# EAGLE design Desertlure (EAGLE 7.3.0)
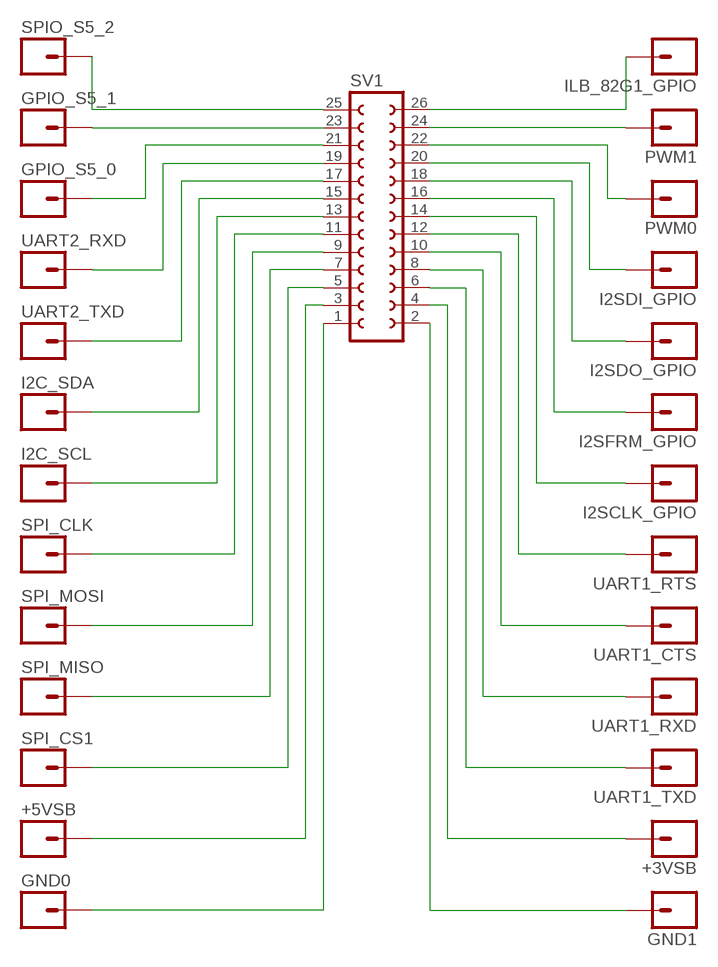
[diagram p0: schematic, sheet 1]

## Parts
+3VSB  M01NOSILK-KIT  [1X01NS-KIT]
+5VSB  M01NOSILK-KIT  [1X01NS-KIT]
GND0  M01NOSILK-KIT  [1X01NS-KIT]
GND1  M01NOSILK-KIT  [1X01NS-KIT]
GPIO_S5_0  M01NOSILK-KIT  [1X01NS-KIT]
GPIO_S5_1  M01NOSILK-KIT  [1X01NS-KIT]
I2C_SCL  M01NOSILK-KIT  [1X01NS-KIT]
I2C_SDA  M01NOSILK-KIT  [1X01NS-KIT]
I2SCLK_GPIO  M01NOSILK-KIT  [1X01NS-KIT]
I2SDI_GPIO  M01NOSILK-KIT  [1X01NS-KIT]
I2SDO_GPIO  M01NOSILK-KIT  [1X01NS-KIT]
I2SFRM_GPIO  M01NOSILK-KIT  [1X01NS-KIT]
ILB_82G1_GPIO  M01NOSILK-KIT  [1X01NS-KIT]
PWM0  M01NOSILK-KIT  [1X01NS-KIT]
PWM1  M01NOSILK-KIT  [1X01NS-KIT]
SPI_CLK  M01NOSILK-KIT  [1X01NS-KIT]
SPI_CS1  M01NOSILK-KIT  [1X01NS-KIT]
SPI_MISO  M01NOSILK-KIT  [1X01NS-KIT]
SPI_MOSI  M01NOSILK-KIT  [1X01NS-KIT]
SPIO_S5_2  M01NOSILK-KIT  [1X01NS-KIT]
SV1  FE13-2W  [FE13-2W]
UART1_CTS  M01NOSILK-KIT  [1X01NS-KIT]
UART1_RTS  M01NOSILK-KIT  [1X01NS-KIT]
UART1_RXD  M01NOSILK-KIT  [1X01NS-KIT]
UART1_TXD  M01NOSILK-KIT  [1X01NS-KIT]
UART2_RXD  M01NOSILK-KIT  [1X01NS-KIT]
UART2_TXD  M01NOSILK-KIT  [1X01NS-KIT]

## Nets
N$1: GND0.1 SV1.1
N$2: +5VSB.1 SV1.3
N$3: SPI_CS1.1 SV1.5
N$4: SPI_MISO.1 SV1.7
N$5: SPI_MOSI.1 SV1.9
N$6: SPI_CLK.1 SV1.11
N$7: I2C_SCL.1 SV1.13
N$8: I2C_SDA.1 SV1.15
N$9: SV1.17 UART2_TXD.1
N$10: SV1.19 UART2_RXD.1
N$11: GPIO_S5_0.1 SV1.21
N$12: GPIO_S5_1.1 SV1.23
N$13: SPIO_S5_2.1 SV1.25
N$14: GND1.1 SV1.2
N$15: +3VSB.1 SV1.4
N$16: SV1.6 UART1_TXD.1
N$17: SV1.8 UART1_RXD.1
N$18: SV1.10 UART1_CTS.1
N$19: SV1.12 UART1_RTS.1
N$20: I2SCLK_GPIO.1 SV1.14
N$21: I2SFRM_GPIO.1 SV1.16
N$22: I2SDO_GPIO.1 SV1.18
N$23: I2SDI_GPIO.1 SV1.20
N$24: PWM0.1 SV1.22
N$25: PWM1.1 SV1.24
N$26: ILB_82G1_GPIO.1 SV1.26

## Library data of the parts
+3VSB +5VSB GND0 GND1 GPIO_S5_0 GPIO_S5_1 I2C_SCL I2C_SDA I2SCLK_GPIO I2SDI_GPIO I2SDO_GPIO I2SFRM_GPIO ILB_82G1_GPIO PWM0 PWM1 SPI_CLK SPI_CS1 SPI_MISO SPI_MOSI SPIO_S5_2 UART1_CTS UART1_RTS UART1_RXD UART1_TXD UART2_RXD UART2_TXD = SparkFun-Connectors:M01: Header 1 Standard 1-pin 0.1" header. Use with straight break away headers (SKU : PRT-00116), right angle break away headers (PRT-00553), swiss pins (PRT-00743), machine pins (PRT-00117), and female headers (PRT-00115).
SV1 = con-lsta:FE13-2W: FEMALE HEADER; OC_FARNELL: unknown; OC_NEWARK: unknown

## Board
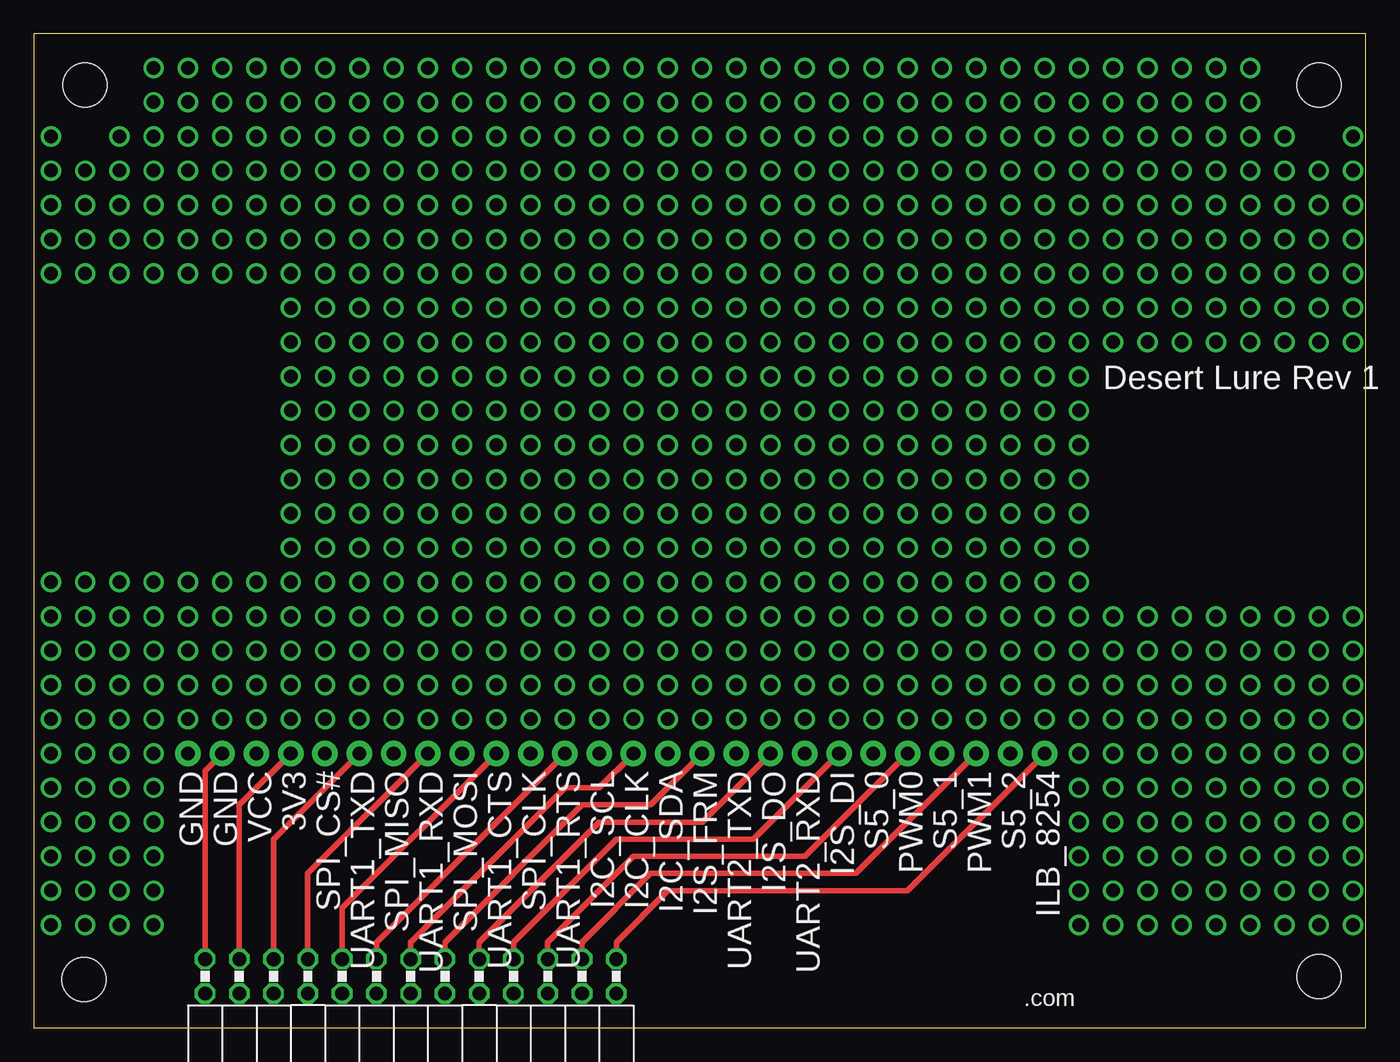
[diagram p1: board, top side]
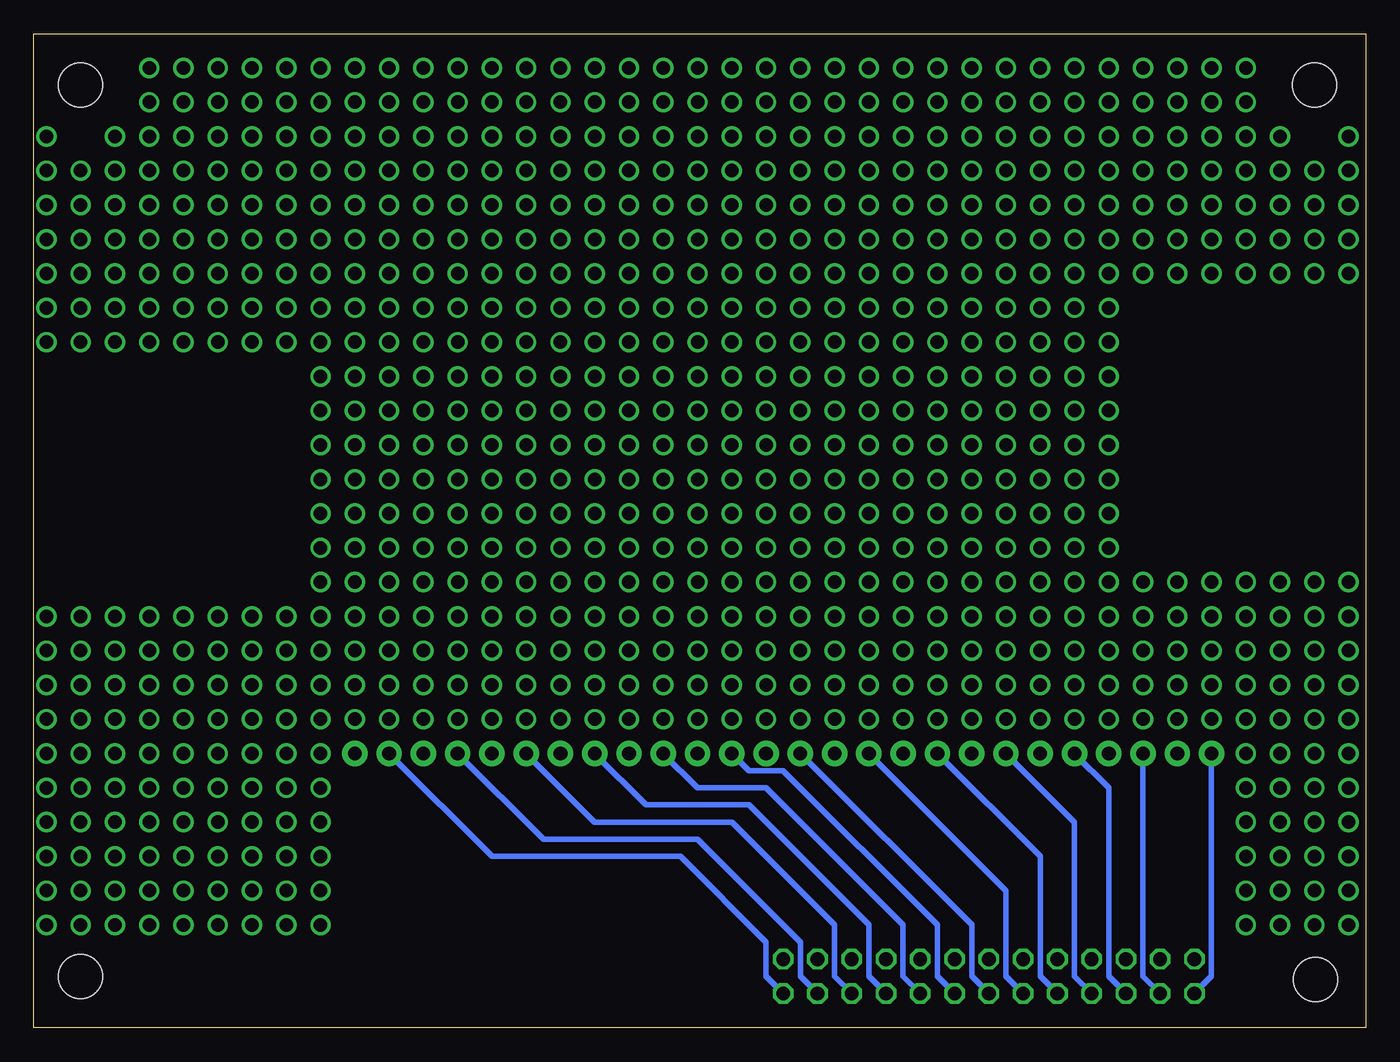
[diagram p2: board, bottom side, seen from below]

Size 98.73 x 73.65 mm. Coordinates in mm from the lower left corner, seen from the top.
Outline: 0,0 98.73,0 98.73,73.65 0,73.65 0,0
Copper layers (1*16): Top 0.035mm / dielectric 1.5mm / Bottom 0.035mm
Design rules "default": minimum track width 10mil, minimum drill 24mil, track to track 8mil, track to pad 8mil, pad to pad 8mil, via to via 8mil, smd to smd 8mil, copper to edge 40mil, drill to drill 8mil, minimum pad ring 10mil, minimum via ring 8mil, stop-mask expansion 4mil, vias tented up to drill 0mil, thermal gap 10mil
Holes 3.28 mm at 3.71,3.58 95.25,3.81 95.25,69.85 3.81,69.85

### Footprints (pad centres in the part's own frame; a part is rotated, then mirrored left to right if it is on the bottom)
1X01NS-KIT = drill 1.016 pad 1.88: 1 0,0
FE13-2W = drill 1.016 octagon: 1 -15.24,1.27; 2 -15.24,-1.27; 3 -12.7,1.27; 4 -12.7,-1.27; 5 -10.16,1.27; 6 -10.16,-1.27; 7 -7.62,1.27; 8 -7.62,-1.27; 9 -5.08,1.27; 10 -5.08,-1.27; 11 -2.54,1.27; 12 -2.54,-1.27; 13 0,1.27; 14 0,-1.27; 15 2.54,1.27; 16 2.54,-1.27; 17 5.08,1.27; 18 5.08,-1.27; 19 7.62,1.27; 20 7.62,-1.27; 21 10.16,1.27; 22 10.16,-1.27; 23 12.7,1.27; 24 12.7,-1.27; 25 15.24,1.27; 26 15.24,-1.27

### Placement (x,y rotation side)
+3VSB  16.51,20.32 0 top
+5VSB  19.05,20.32 0 top
GND0  13.97,20.32 0 top
GND1  11.43,20.32 0 top
GPIO_S5_0  64.77,20.32 0 top
GPIO_S5_1  69.85,20.32 0 top
I2C_SCL  44.45,20.32 0 top
I2C_SDA  49.53,20.32 0 top
I2SCLK_GPIO  41.91,20.32 0 top
I2SDI_GPIO  57.15,20.32 0 top
I2SDO_GPIO  52.07,20.32 0 top
I2SFRM_GPIO  46.99,20.32 0 top
ILB_82G1_GPIO  72.39,20.32 0 top
PWM0  62.23,20.32 0 top
PWM1  67.31,20.32 0 top
SPI_CLK  39.37,20.32 0 top
SPI_CS1  24.13,20.32 0 top
SPI_MISO  29.21,20.32 0 top
SPI_MOSI  34.29,20.32 0 top
SPIO_S5_2  74.93,20.32 0 top
SV1  27.94,3.81 0 top
UART1_CTS  31.75,20.32 0 top
UART1_RTS  36.83,20.32 0 top
UART1_RXD  26.67,20.32 0 top
UART1_TXD  21.59,20.32 0 top
UART2_RXD  59.69,20.32 0 top
UART2_TXD  54.61,20.32 0 top

### Tracks (layer width: path | path; a pad name or v marks a point on that pad's centre or on a via)
N$1
  Top 0.406: SV1.1 12.7,19.05 GND0.1
N$2
  Top 0.406: SV1.3 15.24,16.51 +5VSB.1
N$3
  Top 0.406: SV1.5 17.78,13.97 SPI_CS1.1
N$4
  Top 0.406: SV1.7 20.32,11.43 SPI_MISO.1
N$5
  Top 0.406: SV1.9 22.86,8.89 SPI_MOSI.1
N$6
  Top 0.406: SV1.11 25.4,6.35 SPI_CLK.1
N$7
  Top 0.406: SV1.13 27.94,6.35 39.37,17.78 41.91,17.78 I2C_SCL.1
N$8
  Top 0.406: SV1.15 30.48,6.35 40.64,16.51 45.72,16.51 I2C_SDA.1
N$9
  Top 0.406: SV1.17 33.02,6.35 41.91,15.24 49.53,15.24 UART2_TXD.1
N$10
  Top 0.406: SV1.19 35.56,6.35 43.18,13.97 53.34,13.97 UART2_RXD.1
N$11
  Top 0.406: SV1.21 38.1,6.35 44.45,12.7 57.15,12.7 GPIO_S5_0.1
N$12
  Top 0.406: SV1.23 40.64,6.35 45.72,11.43 60.96,11.43 GPIO_S5_1.1
N$13
  Top 0.406: SV1.25 43.18,6.35 46.99,10.16 64.77,10.16 SPIO_S5_2.1
N$14
  Bottom 0.406: SV1.2 11.43,3.81 GND1.1
N$15
  Bottom 0.406: SV1.4 16.51,3.81 +3VSB.1
N$16
  Bottom 0.406: SV1.6 19.05,3.81 19.05,17.78 UART1_TXD.1
N$17
  Bottom 0.406: SV1.8 21.59,3.81 21.59,15.24 UART1_RXD.1
N$18
  Bottom 0.406: SV1.10 24.13,3.81 24.13,12.7 UART1_CTS.1
N$19
  Bottom 0.406: SV1.12 26.67,3.81 26.67,10.16 UART1_RTS.1
N$20
  Bottom 0.406: SV1.14 29.21,3.81 29.21,7.62 I2SCLK_GPIO.1
N$21
  Bottom 0.406: SV1.16 31.75,3.81 31.75,7.62 43.18,19.05 45.72,19.05 I2SFRM_GPIO.1
N$22
  Bottom 0.406: SV1.18 34.29,3.81 34.29,7.62 44.45,17.78 49.53,17.78 I2SDO_GPIO.1
N$23
  Bottom 0.406: SV1.20 36.83,3.81 36.83,7.62 45.72,16.51 53.34,16.51 I2SDI_GPIO.1
N$24
  Bottom 0.406: SV1.22 39.37,3.81 39.37,7.62 46.99,15.24 57.15,15.24 PWM0.1
N$25
  Bottom 0.406: SV1.24 41.91,3.81 41.91,6.35 49.53,13.97 60.96,13.97 PWM1.1
N$26
  Bottom 0.406: SV1.26 44.45,3.81 44.45,6.35 50.8,12.7 64.77,12.7 ILB_82G1_GPIO.1
N$27  (via drill 1)
  other vias: 11.43,22.86
N$28  (via drill 1)
  other vias: 13.97,22.86
N$29  (via drill 1)
  other vias: 16.51,22.86
N$30  (via drill 1)
  other vias: 19.05,22.86
N$31  (via drill 1)
  other vias: 21.59,22.86
N$32  (via drill 1)
  other vias: 24.13,22.86
N$33  (via drill 1)
  other vias: 26.67,22.86
N$34  (via drill 1)
  other vias: 29.21,22.86
N$35  (via drill 1)
  other vias: 31.75,22.86
N$36  (via drill 1)
  other vias: 34.29,22.86
N$37  (via drill 1)
  other vias: 36.83,22.86
N$38  (via drill 1)
  other vias: 39.37,22.86
N$39  (via drill 1)
  other vias: 41.91,22.86
N$40  (via drill 1)
  other vias: 44.45,22.86
N$41  (via drill 1)
  other vias: 46.99,22.86
N$42  (via drill 1)
  other vias: 49.53,22.86
N$43  (via drill 1)
  other vias: 52.07,22.86
N$44  (via drill 1)
  other vias: 54.61,22.86
N$45  (via drill 1)
  other vias: 57.15,22.86
N$46  (via drill 1)
  other vias: 59.69,22.86
N$47  (via drill 1)
  other vias: 62.23,22.86
N$48  (via drill 1)
  other vias: 64.77,22.86
N$49  (via drill 1)
  other vias: 67.31,22.86
N$50  (via drill 1)
  other vias: 69.85,22.86
N$51  (via drill 1)
  other vias: 72.39,22.86
N$52  (via drill 1)
  other vias: 74.93,22.86
N$53  (via drill 1)
  other vias: 74.93,25.4
N$54  (via drill 1)
  other vias: 77.47,22.86
N$55  (via drill 1)
  other vias: 77.47,20.32
N$56  (via drill 1)
  other vias: 77.47,25.4
N$57  (via drill 1)
  other vias: 72.39,25.4
N$58  (via drill 1)
  other vias: 69.85,25.4
N$59  (via drill 1)
  other vias: 67.31,25.4
N$60  (via drill 1)
  other vias: 64.77,25.4
N$61  (via drill 1)
  other vias: 62.23,25.4
N$62  (via drill 1)
  other vias: 59.69,25.4
N$63  (via drill 1)
  other vias: 57.15,25.4
N$64  (via drill 1)
  other vias: 54.61,25.4
N$65  (via drill 1)
  other vias: 52.07,25.4
N$66  (via drill 1)
  other vias: 49.53,25.4
N$67  (via drill 1)
  other vias: 46.99,25.4
N$68  (via drill 1)
  other vias: 44.45,25.4
N$69  (via drill 1)
  other vias: 41.91,25.4
N$70  (via drill 1)
  other vias: 39.37,25.4
N$71  (via drill 1)
  other vias: 36.83,25.4
N$72  (via drill 1)
  other vias: 34.29,25.4
N$73  (via drill 1)
  other vias: 31.75,25.4
N$74  (via drill 1)
  other vias: 29.21,25.4
N$75  (via drill 1)
  other vias: 26.67,25.4
N$76  (via drill 1)
  other vias: 24.13,25.4
N$77  (via drill 1)
  other vias: 21.59,25.4
N$78  (via drill 1)
  other vias: 19.05,25.4
N$79  (via drill 1)
  other vias: 16.51,25.4
N$80  (via drill 1)
  other vias: 13.97,25.4
N$81  (via drill 1)
  other vias: 11.43,25.4
N$82  (via drill 1)
  other vias: 8.89,25.4
N$83  (via drill 1)
  other vias: 8.89,22.86
N$84  (via drill 1)
  other vias: 8.89,20.32
N$85  (via drill 1)
  other vias: 6.35,20.32
N$86  (via drill 1)
  other vias: 6.35,22.86
N$87  (via drill 1)
  other vias: 6.35,25.4
N$88  (via drill 1)
  other vias: 3.81,25.4
N$89  (via drill 1)
  other vias: 3.81,22.86
N$90  (via drill 1)
  other vias: 3.81,20.32
N$91  (via drill 1)
  other vias: 3.81,17.78
N$92  (via drill 1)
  other vias: 6.35,17.78
N$93  (via drill 1)
  other vias: 8.89,17.78
N$94  (via drill 1)
  other vias: 3.81,15.24
N$95  (via drill 1)
  other vias: 6.35,15.24
N$96  (via drill 1)
  other vias: 8.89,15.24
N$97  (via drill 1)
  other vias: 3.81,12.7
N$98  (via drill 1)
  other vias: 6.35,12.7
N$99  (via drill 1)
  other vias: 8.89,12.7
N$100  (via drill 1)
  other vias: 80.01,22.86
N$101  (via drill 1)
  other vias: 82.55,22.86
N$102  (via drill 1)
  other vias: 85.09,22.86
N$103  (via drill 1)
  other vias: 87.63,22.86
N$104  (via drill 1)
  other vias: 90.17,22.86
N$105  (via drill 1)
  other vias: 92.71,22.86
N$106  (via drill 1)
  other vias: 95.25,22.86
N$107  (via drill 1)
  other vias: 97.79,22.86
N$108  (via drill 1)
  other vias: 80.01,20.32
N$109  (via drill 1)
  other vias: 77.47,17.78
N$110  (via drill 1)
  other vias: 80.01,17.78
N$111  (via drill 1)
  other vias: 77.47,15.24
N$112  (via drill 1)
  other vias: 80.01,15.24
N$113  (via drill 1)
  other vias: 1.27,20.32
N$114  (via drill 1)
  other vias: 1.27,17.78
N$115  (via drill 1)
  other vias: 1.27,15.24
N$116  (via drill 1)
  other vias: 1.27,12.7
N$117  (via drill 1)
  other vias: 1.27,10.16
N$118  (via drill 1)
  other vias: 3.81,10.16
N$119  (via drill 1)
  other vias: 6.35,10.16
N$120  (via drill 1)
  other vias: 8.89,10.16
N$121  (via drill 1)
  other vias: 8.89,7.62
N$122  (via drill 1)
  other vias: 6.35,7.62
N$123  (via drill 1)
  other vias: 3.81,7.62
N$124  (via drill 1)
  other vias: 1.27,7.62
N$125  (via drill 1)
  other vias: 82.55,20.32
N$126  (via drill 1)
  other vias: 82.55,17.78
N$127  (via drill 1)
  other vias: 82.55,15.24
N$128  (via drill 1)
  other vias: 82.55,12.7
N$129  (via drill 1)
  other vias: 80.01,12.7
N$130  (via drill 1)
  other vias: 77.47,12.7
N$131  (via drill 1)
  other vias: 77.47,10.16
N$132  (via drill 1)
  other vias: 80.01,10.16
N$133  (via drill 1)
  other vias: 82.55,10.16
N$134  (via drill 1)
  other vias: 85.09,20.32
N$135  (via drill 1)
  other vias: 85.09,17.78
N$136  (via drill 1)
  other vias: 85.09,15.24
N$137  (via drill 1)
  other vias: 85.09,12.7
N$138  (via drill 1)
  other vias: 85.09,10.16
N$139  (via drill 1)
  other vias: 87.63,20.32
N$140  (via drill 1)
  other vias: 87.63,17.78
N$141  (via drill 1)
  other vias: 87.63,15.24
N$142  (via drill 1)
  other vias: 87.63,12.7
N$143  (via drill 1)
  other vias: 87.63,10.16
N$144  (via drill 1)
  other vias: 90.17,20.32
N$145  (via drill 1)
  other vias: 90.17,17.78
N$146  (via drill 1)
  other vias: 90.17,15.24
N$147  (via drill 1)
  other vias: 90.17,12.7
N$148  (via drill 1)
  other vias: 90.17,10.16
N$149  (via drill 1)
  other vias: 92.71,20.32
N$150  (via drill 1)
  other vias: 92.71,17.78
N$151  (via drill 1)
  other vias: 92.71,15.24
N$152  (via drill 1)
  other vias: 92.71,12.7
N$153  (via drill 1)
  other vias: 92.71,10.16
N$154  (via drill 1)
  other vias: 95.25,20.32
N$155  (via drill 1)
  other vias: 95.25,17.78
N$156  (via drill 1)
  other vias: 95.25,15.24
N$157  (via drill 1)
  other vias: 95.25,12.7
N$158  (via drill 1)
  other vias: 95.25,10.16
N$159  (via drill 1)
  other vias: 97.79,20.32
N$160  (via drill 1)
  other vias: 97.79,17.78
N$161  (via drill 1)
  other vias: 97.79,15.24
N$162  (via drill 1)
  other vias: 97.79,12.7
N$163  (via drill 1)
  other vias: 97.79,10.16
N$164  (via drill 1)
  other vias: 80.01,25.4
N$165  (via drill 1)
  other vias: 82.55,25.4
N$166  (via drill 1)
  other vias: 85.09,25.4
N$167  (via drill 1)
  other vias: 87.63,25.4
N$168  (via drill 1)
  other vias: 90.17,25.4
N$169  (via drill 1)
  other vias: 92.71,25.4
N$170  (via drill 1)
  other vias: 95.25,25.4
N$171  (via drill 1)
  other vias: 97.79,25.4
N$172  (via drill 1)
  other vias: 1.27,25.4
N$173  (via drill 1)
  other vias: 1.27,22.86
N$174  (via drill 1)
  other vias: 77.47,7.62
N$175  (via drill 1)
  other vias: 80.01,7.62
N$176  (via drill 1)
  other vias: 82.55,7.62
N$177  (via drill 1)
  other vias: 85.09,7.62
N$178  (via drill 1)
  other vias: 87.63,7.62
N$179  (via drill 1)
  other vias: 90.17,7.62
N$180  (via drill 1)
  other vias: 92.71,7.62
N$181  (via drill 1)
  other vias: 95.25,7.62
N$182  (via drill 1)
  other vias: 97.79,7.62
N$183  (via drill 1)
  other vias: 1.27,27.94
N$184  (via drill 1)
  other vias: 3.81,27.94
N$185  (via drill 1)
  other vias: 6.35,27.94
N$186  (via drill 1)
  other vias: 8.89,27.94
N$187  (via drill 1)
  other vias: 11.43,27.94
N$188  (via drill 1)
  other vias: 13.97,27.94
N$189  (via drill 1)
  other vias: 16.51,27.94
N$190  (via drill 1)
  other vias: 19.05,27.94
N$191  (via drill 1)
  other vias: 21.59,27.94
N$192  (via drill 1)
  other vias: 24.13,27.94
N$193  (via drill 1)
  other vias: 26.67,27.94
N$194  (via drill 1)
  other vias: 29.21,27.94
N$195  (via drill 1)
  other vias: 31.75,27.94
N$196  (via drill 1)
  other vias: 34.29,27.94
N$197  (via drill 1)
  other vias: 36.83,27.94
N$198  (via drill 1)
  other vias: 39.37,27.94
N$199  (via drill 1)
  other vias: 41.91,27.94
N$200  (via drill 1)
  other vias: 44.45,27.94
N$201  (via drill 1)
  other vias: 46.99,27.94
N$202  (via drill 1)
  other vias: 49.53,27.94
N$203  (via drill 1)
  other vias: 52.07,27.94
N$204  (via drill 1)
  other vias: 54.61,27.94
N$205  (via drill 1)
  other vias: 57.15,27.94
N$206  (via drill 1)
  other vias: 59.69,27.94
N$207  (via drill 1)
  other vias: 62.23,27.94
N$208  (via drill 1)
  other vias: 64.77,27.94
N$209  (via drill 1)
  other vias: 67.31,27.94
N$210  (via drill 1)
  other vias: 69.85,27.94
N$211  (via drill 1)
  other vias: 72.39,27.94
N$212  (via drill 1)
  other vias: 74.93,27.94
N$213  (via drill 1)
  other vias: 77.47,27.94
N$214  (via drill 1)
  other vias: 80.01,27.94
N$215  (via drill 1)
  other vias: 82.55,27.94
N$216  (via drill 1)
  other vias: 85.09,27.94
N$217  (via drill 1)
  other vias: 87.63,27.94
N$218  (via drill 1)
  other vias: 90.17,27.94
N$219  (via drill 1)
  other vias: 92.71,27.94
N$220  (via drill 1)
  other vias: 95.25,27.94
N$221  (via drill 1)
  other vias: 97.79,27.94
N$222  (via drill 1)
  other vias: 97.79,30.48
N$223  (via drill 1)
  other vias: 95.25,30.48
N$224  (via drill 1)
  other vias: 92.71,30.48
N$225  (via drill 1)
  other vias: 90.17,30.48
N$226  (via drill 1)
  other vias: 87.63,30.48
N$227  (via drill 1)
  other vias: 85.09,30.48
N$228  (via drill 1)
  other vias: 82.55,30.48
N$229  (via drill 1)
  other vias: 80.01,30.48
N$230  (via drill 1)
  other vias: 77.47,30.48
N$231  (via drill 1)
  other vias: 74.93,30.48
N$232  (via drill 1)
  other vias: 72.39,30.48
N$233  (via drill 1)
  other vias: 69.85,30.48
N$234  (via drill 1)
  other vias: 67.31,30.48
N$235  (via drill 1)
  other vias: 64.77,30.48
N$236  (via drill 1)
  other vias: 62.23,30.48
N$237  (via drill 1)
  other vias: 59.69,30.48
N$238  (via drill 1)
  other vias: 57.15,30.48
N$239  (via drill 1)
  other vias: 54.61,30.48
N$240  (via drill 1)
  other vias: 52.07,30.48
N$241  (via drill 1)
  other vias: 49.53,30.48
N$242  (via drill 1)
  other vias: 46.99,30.48
N$243  (via drill 1)
  other vias: 44.45,30.48
N$244  (via drill 1)
  other vias: 41.91,30.48
N$245  (via drill 1)
  other vias: 39.37,30.48
N$246  (via drill 1)
  other vias: 36.83,30.48
N$247  (via drill 1)
  other vias: 34.29,30.48
N$248  (via drill 1)
  other vias: 31.75,30.48
N$249  (via drill 1)
  other vias: 29.21,30.48
N$250  (via drill 1)
  other vias: 26.67,30.48
N$251  (via drill 1)
  other vias: 24.13,30.48
N$252  (via drill 1)
  other vias: 21.59,30.48
N$253  (via drill 1)
  other vias: 19.05,30.48
N$254  (via drill 1)
  other vias: 16.51,30.48
N$255  (via drill 1)
  other vias: 13.97,30.48 1.27,33.02
N$256  (via drill 1)
  other vias: 11.43,30.48
N$257  (via drill 1)
  other vias: 8.89,30.48
N$258  (via drill 1)
  other vias: 6.35,30.48
N$259  (via drill 1)
  other vias: 3.81,30.48
N$260  (via drill 1)
  other vias: 1.27,30.48
N$261  (via drill 1)
  other vias: 3.81,33.02
N$262  (via drill 1)
  other vias: 6.35,33.02
N$263  (via drill 1)
  other vias: 8.89,33.02
N$264  (via drill 1)
  other vias: 11.43,33.02
N$265  (via drill 1)
  other vias: 13.97,33.02
N$266  (via drill 1)
  other vias: 16.51,33.02
N$267  (via drill 1)
  other vias: 19.05,33.02
N$268  (via drill 1)
  other vias: 21.59,33.02
N$269  (via drill 1)
  other vias: 24.13,33.02
N$270  (via drill 1)
  other vias: 26.67,33.02
N$271  (via drill 1)
  other vias: 29.21,33.02
N$272  (via drill 1)
  other vias: 31.75,33.02
N$273  (via drill 1)
  other vias: 34.29,33.02
N$274  (via drill 1)
  other vias: 36.83,33.02
N$275  (via drill 1)
  other vias: 39.37,33.02
N$276  (via drill 1)
  other vias: 41.91,33.02
N$277  (via drill 1)
  other vias: 44.45,33.02
N$278  (via drill 1)
  other vias: 46.99,33.02
N$279  (via drill 1)
  other vias: 49.53,33.02
N$280  (via drill 1)
  other vias: 52.07,33.02
N$281  (via drill 1)
  other vias: 54.61,33.02
N$282  (via drill 1)
  other vias: 57.15,33.02
N$283  (via drill 1)
  other vias: 59.69,33.02
N$284  (via drill 1)
  other vias: 62.23,33.02
N$285  (via drill 1)
  other vias: 64.77,33.02
N$286  (via drill 1)
  other vias: 67.31,33.02
N$287  (via drill 1)
  other vias: 69.85,33.02
N$288  (via drill 1)
  other vias: 72.39,33.02
N$289  (via drill 1)
  other vias: 74.93,33.02
N$290  (via drill 1)
  other vias: 77.47,33.02
N$299  (via drill 1)
  other vias: 46.99,35.56
N$300  (via drill 1)
  other vias: 46.99,38.1
N$301  (via drill 1)
  other vias: 46.99,40.64
N$302  (via drill 1)
  other vias: 46.99,43.18
N$303  (via drill 1)
  other vias: 46.99,45.72
N$304  (via drill 1)
  other vias: 46.99,48.26
N$305  (via drill 1)
  other vias: 46.99,50.8
N$306  (via drill 1)
  other vias: 46.99,53.34
N$307  (via drill 1)
  other vias: 46.99,55.88
N$308  (via drill 1)
  other vias: 46.99,58.42
N$309  (via drill 1)
  other vias: 46.99,60.96
N$310  (via drill 1)
  other vias: 46.99,63.5
N$311  (via drill 1)
  other vias: 46.99,66.04
N$312  (via drill 1)
  other vias: 46.99,68.58
N$313  (via drill 1)
  other vias: 46.99,71.12
N$314  (via drill 1)
  other vias: 44.45,71.12
N$315  (via drill 1)
  other vias: 41.91,71.12
N$316  (via drill 1)
  other vias: 39.37,71.12
N$317  (via drill 1)
  other vias: 36.83,71.12
N$318  (via drill 1)
  other vias: 34.29,71.12
N$319  (via drill 1)
  other vias: 31.75,71.12
N$320  (via drill 1)
  other vias: 29.21,71.12
N$321  (via drill 1)
  other vias: 26.67,71.12
N$322  (via drill 1)
  other vias: 24.13,71.12
N$323  (via drill 1)
  other vias: 21.59,71.12
N$324  (via drill 1)
  other vias: 19.05,71.12
N$325  (via drill 1)
  other vias: 16.51,71.12
N$326  (via drill 1)
  other vias: 13.97,71.12
N$327  (via drill 1)
  other vias: 11.43,71.12
N$328  (via drill 1)
  other vias: 8.89,71.12
N$331  (via drill 1)
  other vias: 6.35,66.04 1.27,66.04 97.79,66.04
N$334  (via drill 1)
  other vias: 8.89,68.58
N$335  (via drill 1)
  other vias: 8.89,66.04
N$336  (via drill 1)
  other vias: 6.35,63.5
N$337  (via drill 1)
  other vias: 3.81,63.5
N$338  (via drill 1)
  other vias: 1.27,63.5
N$339  (via drill 1)
  other vias: 8.89,63.5
N$340  (via drill 1)
  other vias: 11.43,68.58
N$341  (via drill 1)
  other vias: 13.97,68.58
N$342  (via drill 1)
  other vias: 11.43,66.04
N$343  (via drill 1)
  other vias: 13.97,66.04
N$344  (via drill 1)
  other vias: 11.43,63.5
N$345  (via drill 1)
  other vias: 13.97,63.5
N$346  (via drill 1)
  other vias: 1.27,60.96
N$347  (via drill 1)
  other vias: 1.27,58.42
N$348  (via drill 1)
  other vias: 3.81,60.96
N$349  (via drill 1)
  other vias: 3.81,58.42
N$350  (via drill 1)
  other vias: 6.35,60.96
N$351  (via drill 1)
  other vias: 6.35,58.42
N$352  (via drill 1)
  other vias: 8.89,60.96
N$353  (via drill 1)
  other vias: 8.89,58.42
N$354  (via drill 1)
  other vias: 11.43,60.96
N$355  (via drill 1)
  other vias: 11.43,58.42
N$356  (via drill 1)
  other vias: 13.97,60.96
N$357  (via drill 1)
  other vias: 13.97,58.42
N$358  (via drill 1)
  other vias: 16.51,68.58
N$359  (via drill 1)
  other vias: 19.05,68.58
N$360  (via drill 1)
  other vias: 21.59,68.58
N$361  (via drill 1)
  other vias: 24.13,68.58
N$362  (via drill 1)
  other vias: 26.67,68.58
N$363  (via drill 1)
  other vias: 29.21,68.58
N$364  (via drill 1)
  other vias: 31.75,68.58
N$365  (via drill 1)
  other vias: 34.29,68.58
N$366  (via drill 1)
  other vias: 36.83,68.58
N$367  (via drill 1)
  other vias: 39.37,68.58
N$368  (via drill 1)
  other vias: 41.91,68.58
N$369  (via drill 1)
  other vias: 44.45,68.58
N$370  (via drill 1)
  other vias: 44.45,66.04
N$371  (via drill 1)
  other vias: 41.91,66.04
N$372  (via drill 1)
  other vias: 39.37,66.04
N$373  (via drill 1)
  other vias: 36.83,66.04
N$374  (via drill 1)
  other vias: 34.29,66.04
N$375  (via drill 1)
  other vias: 31.75,66.04
N$376  (via drill 1)
  other vias: 29.21,66.04
N$377  (via drill 1)
  other vias: 26.67,66.04
N$378  (via drill 1)
  other vias: 24.13,66.04
N$379  (via drill 1)
  other vias: 21.59,66.04
N$380  (via drill 1)
  other vias: 19.05,66.04
N$381  (via drill 1)
  other vias: 16.51,66.04
N$382  (via drill 1)
  other vias: 16.51,63.5
N$383  (via drill 1)
  other vias: 19.05,63.5
N$384  (via drill 1)
  other vias: 21.59,63.5
N$385  (via drill 1)
  other vias: 24.13,63.5
N$386  (via drill 1)
  other vias: 26.67,63.5
N$387  (via drill 1)
  other vias: 29.21,63.5
N$388  (via drill 1)
  other vias: 31.75,63.5
N$389  (via drill 1)
  other vias: 34.29,63.5
N$390  (via drill 1)
  other vias: 36.83,63.5
N$391  (via drill 1)
  other vias: 39.37,63.5
N$392  (via drill 1)
  other vias: 41.91,63.5
N$393  (via drill 1)
  other vias: 44.45,63.5
N$394  (via drill 1)
  other vias: 44.45,60.96
N$395  (via drill 1)
  other vias: 41.91,60.96
N$396  (via drill 1)
  other vias: 39.37,60.96
N$397  (via drill 1)
  other vias: 36.83,60.96
N$398  (via drill 1)
  other vias: 34.29,60.96
N$399  (via drill 1)
  other vias: 31.75,60.96
N$400  (via drill 1)
  other vias: 29.21,60.96
N$401  (via drill 1)
  other vias: 26.67,60.96
N$402  (via drill 1)
  other vias: 24.13,60.96
N$403  (via drill 1)
  other vias: 21.59,60.96
N$404  (via drill 1)
  other vias: 19.05,60.96
N$405  (via drill 1)
  other vias: 16.51,60.96
N$406  (via drill 1)
  other vias: 16.51,58.42
N$407  (via drill 1)
  other vias: 19.05,58.42
N$408  (via drill 1)
  other vias: 21.59,58.42
N$409  (via drill 1)
  other vias: 24.13,58.42
N$410  (via drill 1)
  other vias: 26.67,58.42
N$411  (via drill 1)
  other vias: 29.21,58.42
N$412  (via drill 1)
  other vias: 31.75,58.42
N$413  (via drill 1)
  other vias: 34.29,58.42
N$414  (via drill 1)
  other vias: 36.83,58.42
N$415  (via drill 1)
  other vias: 39.37,58.42
N$416  (via drill 1)
  other vias: 41.91,58.42
N$417  (via drill 1)
  other vias: 44.45,58.42
N$418  (via drill 1)
  other vias: 49.53,58.42
N$419  (via drill 1)
  other vias: 52.07,58.42
N$420  (via drill 1)
  other vias: 54.61,58.42
N$421  (via drill 1)
  other vias: 57.15,58.42
N$422  (via drill 1)
  other vias: 59.69,58.42
N$423  (via drill 1)
  other vias: 62.23,58.42
N$424  (via drill 1)
  other vias: 64.77,58.42
N$425  (via drill 1)
  other vias: 67.31,58.42
N$426  (via drill 1)
  other vias: 69.85,58.42
N$427  (via drill 1)
  other vias: 72.39,58.42
N$428  (via drill 1)
  other vias: 74.93,58.42
N$429  (via drill 1)
  other vias: 77.47,58.42
N$430  (via drill 1)
  other vias: 80.01,58.42 80.01,55.88 80.01,53.34 80.01,50.8 82.55,50.8 82.55,53.34 82.55,55.88 85.09,55.88 85.09,53.34 85.09,50.8 87.63,50.8 87.63,53.34 87.63,55.88 90.17,55.88 90.17,53.34 90.17,50.8 92.71,50.8 92.71,53.34 92.71,55.88 95.25,55.88 95.25,53.34 95.25,50.8 97.79,50.8 97.79,53.34 97.79,55.88 16.51,55.88 13.97,55.88 11.43,55.88 11.43,55.88 8.89,55.88 6.35,55.88 3.81,55.88 1.27,55.88
N$431  (via drill 1)
  other vias: 82.55,58.42
N$432  (via drill 1)
  other vias: 85.09,58.42
N$433  (via drill 1)
  other vias: 87.63,58.42
N$434  (via drill 1)
  other vias: 90.17,58.42
N$435  (via drill 1)
  other vias: 92.71,58.42
N$436  (via drill 1)
  other vias: 95.25,58.42
N$437  (via drill 1)
  other vias: 97.79,58.42
N$438  (via drill 1)
  other vias: 97.79,60.96
N$439  (via drill 1)
  other vias: 95.25,60.96
N$440  (via drill 1)
  other vias: 95.25,63.5
N$441  (via drill 1)
  other vias: 97.79,63.5
N$447  (via drill 1)
  other vias: 92.71,66.04
N$448  (via drill 1)
  other vias: 92.71,63.5
N$449  (via drill 1)
  other vias: 92.71,60.96
N$450  (via drill 1)
  other vias: 90.17,60.96
N$451  (via drill 1)
  other vias: 90.17,63.5
N$452  (via drill 1)
  other vias: 90.17,66.04
N$453  (via drill 1)
  other vias: 90.17,68.58
N$455  (via drill 1)
  other vias: 90.17,71.12
N$456  (via drill 1)
  other vias: 87.63,71.12
N$457  (via drill 1)
  other vias: 87.63,60.96
N$458  (via drill 1)
  other vias: 87.63,63.5
N$459  (via drill 1)
  other vias: 87.63,66.04
N$460  (via drill 1)
  other vias: 87.63,68.58
N$461  (via drill 1)
  other vias: 85.09,71.12
N$462  (via drill 1)
  other vias: 85.09,68.58
N$463  (via drill 1)
  other vias: 85.09,66.04
N$464  (via drill 1)
  other vias: 85.09,63.5
N$465  (via drill 1)
  other vias: 85.09,60.96
N$466  (via drill 1)
  other vias: 82.55,60.96
N$467  (via drill 1)
  other vias: 80.01,60.96
N$468  (via drill 1)
  other vias: 77.47,60.96
N$469  (via drill 1)
  other vias: 74.93,60.96
N$470  (via drill 1)
  other vias: 72.39,60.96
N$471  (via drill 1)
  other vias: 69.85,60.96
N$472  (via drill 1)
  other vias: 67.31,60.96
N$473  (via drill 1)
  other vias: 64.77,60.96
N$474  (via drill 1)
  other vias: 62.23,60.96
N$475  (via drill 1)
  other vias: 59.69,60.96
N$476  (via drill 1)
  other vias: 57.15,60.96
N$477  (via drill 1)
  other vias: 54.61,60.96
N$478  (via drill 1)
  other vias: 52.07,60.96
N$479  (via drill 1)
  other vias: 49.53,60.96
N$480  (via drill 1)
  other vias: 49.53,63.5
N$481  (via drill 1)
  other vias: 52.07,63.5
N$482  (via drill 1)
  other vias: 54.61,63.5
N$483  (via drill 1)
  other vias: 57.15,63.5
N$484  (via drill 1)
  other vias: 59.69,63.5
N$485  (via drill 1)
  other vias: 62.23,63.5
N$486  (via drill 1)
  other vias: 64.77,63.5
N$487  (via drill 1)
  other vias: 67.31,63.5
N$488  (via drill 1)
  other vias: 69.85,63.5
N$489  (via drill 1)
  other vias: 72.39,63.5
N$490  (via drill 1)
  other vias: 74.93,63.5
N$491  (via drill 1)
  other vias: 77.47,63.5
N$492  (via drill 1)
  other vias: 80.01,63.5
N$493  (via drill 1)
  other vias: 82.55,63.5
N$494  (via drill 1)
  other vias: 82.55,66.04
N$495  (via drill 1)
  other vias: 80.01,66.04
N$496  (via drill 1)
  other vias: 77.47,66.04
N$497  (via drill 1)
  other vias: 74.93,66.04
N$498  (via drill 1)
  other vias: 72.39,66.04
N$499  (via drill 1)
  other vias: 69.85,66.04
N$500  (via drill 1)
  other vias: 67.31,66.04
N$501  (via drill 1)
  other vias: 64.77,66.04
N$502  (via drill 1)
  other vias: 62.23,66.04
N$503  (via drill 1)
  other vias: 59.69,66.04
N$504  (via drill 1)
  other vias: 57.15,66.04
N$505  (via drill 1)
  other vias: 54.61,66.04
N$506  (via drill 1)
  other vias: 52.07,66.04
N$507  (via drill 1)
  other vias: 49.53,66.04
N$508  (via drill 1)
  other vias: 49.53,68.58
N$509  (via drill 1)
  other vias: 52.07,68.58
N$510  (via drill 1)
  other vias: 54.61,68.58
N$511  (via drill 1)
  other vias: 57.15,68.58
N$512  (via drill 1)
  other vias: 59.69,68.58
N$513  (via drill 1)
  other vias: 62.23,68.58
N$514  (via drill 1)
  other vias: 64.77,68.58
N$515  (via drill 1)
  other vias: 67.31,68.58
N$516  (via drill 1)
  other vias: 69.85,68.58
N$517  (via drill 1)
  other vias: 72.39,68.58
N$518  (via drill 1)
  other vias: 74.93,68.58
N$519  (via drill 1)
  other vias: 77.47,68.58
N$520  (via drill 1)
  other vias: 80.01,68.58
N$521  (via drill 1)
  other vias: 82.55,68.58
N$522  (via drill 1)
  other vias: 82.55,71.12
N$523  (via drill 1)
  other vias: 80.01,71.12
N$524  (via drill 1)
  other vias: 77.47,71.12
N$525  (via drill 1)
  other vias: 74.93,71.12
N$526  (via drill 1)
  other vias: 72.39,71.12
N$527  (via drill 1)
  other vias: 69.85,71.12
N$528  (via drill 1)
  other vias: 67.31,71.12
N$529  (via drill 1)
  other vias: 64.77,71.12
N$530  (via drill 1)
  other vias: 62.23,71.12
N$531  (via drill 1)
  other vias: 59.69,71.12
N$532  (via drill 1)
  other vias: 57.15,71.12
N$533  (via drill 1)
  other vias: 54.61,71.12
N$534  (via drill 1)
  other vias: 52.07,71.12
N$535  (via drill 1)
  other vias: 49.53,71.12
N$536  (via drill 1)
  other vias: 44.45,55.88
N$537  (via drill 1)
  other vias: 44.45,53.34
N$538  (via drill 1)
  other vias: 44.45,50.8
N$539  (via drill 1)
  other vias: 44.45,48.26
N$540  (via drill 1)
  other vias: 44.45,45.72
N$541  (via drill 1)
  other vias: 44.45,43.18
N$542  (via drill 1)
  other vias: 44.45,40.64
N$543  (via drill 1)
  other vias: 44.45,38.1
N$544  (via drill 1)
  other vias: 44.45,35.56
N$545  (via drill 1)
  other vias: 41.91,35.56
N$546  (via drill 1)
  other vias: 41.91,38.1
N$547  (via drill 1)
  other vias: 41.91,40.64
N$548  (via drill 1)
  other vias: 41.91,43.18
N$549  (via drill 1)
  other vias: 41.91,45.72
N$550  (via drill 1)
  other vias: 41.91,48.26
N$551  (via drill 1)
  other vias: 41.91,50.8
N$552  (via drill 1)
  other vias: 41.91,53.34
N$553  (via drill 1)
  other vias: 41.91,55.88
N$554  (via drill 1)
  other vias: 39.37,55.88
N$555  (via drill 1)
  other vias: 39.37,53.34
N$556  (via drill 1)
  other vias: 39.37,50.8
N$557  (via drill 1)
  other vias: 39.37,48.26
N$558  (via drill 1)
  other vias: 39.37,45.72
N$559  (via drill 1)
  other vias: 39.37,43.18
N$560  (via drill 1)
  other vias: 39.37,40.64
N$561  (via drill 1)
  other vias: 39.37,38.1
N$562  (via drill 1)
  other vias: 39.37,35.56
N$563  (via drill 1)
  other vias: 36.83,35.56
N$564  (via drill 1)
  other vias: 36.83,38.1
N$565  (via drill 1)
  other vias: 36.83,40.64
N$566  (via drill 1)
  other vias: 36.83,43.18
N$567  (via drill 1)
  other vias: 36.83,45.72
N$568  (via drill 1)
  other vias: 36.83,48.26
N$569  (via drill 1)
  other vias: 36.83,50.8
N$570  (via drill 1)
  other vias: 36.83,53.34
N$571  (via drill 1)
  other vias: 36.83,55.88
N$572  (via drill 1)
  other vias: 34.29,55.88
N$573  (via drill 1)
  other vias: 34.29,53.34
N$574  (via drill 1)
  other vias: 34.29,50.8
N$575  (via drill 1)
  other vias: 34.29,48.26
N$576  (via drill 1)
  other vias: 34.29,45.72
N$577  (via drill 1)
  other vias: 34.29,43.18
N$578  (via drill 1)
  other vias: 34.29,40.64
N$579  (via drill 1)
  other vias: 34.29,38.1
N$580  (via drill 1)
  other vias: 34.29,35.56
N$581  (via drill 1)
  other vias: 31.75,43.18
N$582  (via drill 1)
  other vias: 29.21,43.18
N$583  (via drill 1)
  other vias: 26.67,43.18
N$584  (via drill 1)
  other vias: 24.13,43.18
N$585  (via drill 1)
  other vias: 21.59,43.18
N$586  (via drill 1)
  other vias: 19.05,43.18
N$587  (via drill 1)
  other vias: 19.05,40.64
N$588  (via drill 1)
  other vias: 19.05,38.1
N$589  (via drill 1)
  other vias: 19.05,35.56
N$590  (via drill 1)
  other vias: 19.05,45.72
N$591  (via drill 1)
  other vias: 19.05,48.26
N$592  (via drill 1)
  other vias: 19.05,50.8
N$593  (via drill 1)
  other vias: 19.05,53.34
N$594  (via drill 1)
  other vias: 19.05,55.88
N$595  (via drill 1)
  other vias: 21.59,55.88
N$596  (via drill 1)
  other vias: 24.13,55.88
N$597  (via drill 1)
  other vias: 26.67,55.88
N$598  (via drill 1)
  other vias: 29.21,55.88
N$599  (via drill 1)
  other vias: 31.75,55.88
N$600  (via drill 1)
  other vias: 31.75,53.34
N$601  (via drill 1)
  other vias: 29.21,53.34
N$602  (via drill 1)
  other vias: 26.67,53.34
N$603  (via drill 1)
  other vias: 24.13,53.34
N$604  (via drill 1)
  other vias: 21.59,53.34
N$605  (via drill 1)
  other vias: 21.59,50.8
N$606  (via drill 1)
  other vias: 24.13,50.8
N$607  (via drill 1)
  other vias: 26.67,50.8
N$608  (via drill 1)
  other vias: 29.21,50.8
N$609  (via drill 1)
  other vias: 31.75,50.8
N$610  (via drill 1)
  other vias: 31.75,48.26
N$611  (via drill 1)
  other vias: 29.21,48.26
N$612  (via drill 1)
  other vias: 26.67,48.26
N$613  (via drill 1)
  other vias: 24.13,48.26
N$614  (via drill 1)
  other vias: 21.59,48.26
N$615  (via drill 1)
  other vias: 21.59,45.72
N$616  (via drill 1)
  other vias: 24.13,45.72
N$617  (via drill 1)
  other vias: 26.67,45.72
N$618  (via drill 1)
  other vias: 29.21,45.72
N$619  (via drill 1)
  other vias: 31.75,45.72
N$620  (via drill 1)
  other vias: 31.75,40.64
N$621  (via drill 1)
  other vias: 29.21,40.64
N$622  (via drill 1)
  other vias: 26.67,40.64
N$623  (via drill 1)
  other vias: 24.13,40.64
N$624  (via drill 1)
  other vias: 21.59,40.64
N$625  (via drill 1)
  other vias: 21.59,38.1
N$626  (via drill 1)
  other vias: 24.13,38.1
N$627  (via drill 1)
  other vias: 26.67,38.1
N$628  (via drill 1)
  other vias: 29.21,38.1
N$629  (via drill 1)
  other vias: 31.75,38.1
N$630  (via drill 1)
  other vias: 31.75,35.56
N$631  (via drill 1)
  other vias: 29.21,35.56
N$632  (via drill 1)
  other vias: 26.67,35.56
N$633  (via drill 1)
  other vias: 24.13,35.56
N$634  (via drill 1)
  other vias: 21.59,35.56
N$635  (via drill 1)
  other vias: 74.93,35.56
N$636  (via drill 1)
  other vias: 74.93,38.1
N$637  (via drill 1)
  other vias: 74.93,40.64
N$638  (via drill 1)
  other vias: 74.93,43.18
N$639  (via drill 1)
  other vias: 74.93,45.72
N$640  (via drill 1)
  other vias: 74.93,48.26
N$641  (via drill 1)
  other vias: 74.93,50.8
N$642  (via drill 1)
  other vias: 74.93,53.34
N$643  (via drill 1)
  other vias: 74.93,55.88
N$644  (via drill 1)
  other vias: 72.39,55.88
N$645  (via drill 1)
  other vias: 72.39,53.34
N$646  (via drill 1)
  other vias: 72.39,50.8
N$647  (via drill 1)
  other vias: 72.39,48.26
N$648  (via drill 1)
  other vias: 72.39,45.72
N$649  (via drill 1)
  other vias: 72.39,43.18
N$650  (via drill 1)
  other vias: 72.39,40.64
N$651  (via drill 1)
  other vias: 72.39,38.1
N$652  (via drill 1)
  other vias: 72.39,35.56
N$653  (via drill 1)
  other vias: 69.85,35.56
N$654  (via drill 1)
  other vias: 69.85,38.1
N$655  (via drill 1)
  other vias: 69.85,40.64
N$656  (via drill 1)
  other vias: 69.85,43.18
N$657  (via drill 1)
  other vias: 69.85,45.72
N$658  (via drill 1)
  other vias: 69.85,48.26
N$659  (via drill 1)
  other vias: 69.85,50.8
N$660  (via drill 1)
  other vias: 69.85,53.34
N$661  (via drill 1)
  other vias: 69.85,55.88
N$662  (via drill 1)
  other vias: 67.31,55.88
N$663  (via drill 1)
  other vias: 67.31,53.34
N$664  (via drill 1)
  other vias: 67.31,50.8
N$665  (via drill 1)
  other vias: 67.31,48.26
N$666  (via drill 1)
  other vias: 67.31,45.72
N$667  (via drill 1)
  other vias: 67.31,43.18
N$668  (via drill 1)
  other vias: 67.31,40.64
N$669  (via drill 1)
  other vias: 67.31,38.1
N$670  (via drill 1)
  other vias: 67.31,35.56
N$671  (via drill 1)
  other vias: 64.77,35.56
N$672  (via drill 1)
  other vias: 64.77,38.1
N$673  (via drill 1)
  other vias: 64.77,40.64
N$674  (via drill 1)
  other vias: 64.77,43.18
N$675  (via drill 1)
  other vias: 64.77,45.72
N$676  (via drill 1)
  other vias: 64.77,48.26
N$677  (via drill 1)
  other vias: 64.77,50.8
N$678  (via drill 1)
  other vias: 64.77,53.34
N$679  (via drill 1)
  other vias: 64.77,55.88
N$680  (via drill 1)
  other vias: 62.23,55.88
N$681  (via drill 1)
  other vias: 59.69,55.88
N$682  (via drill 1)
  other vias: 57.15,55.88
N$683  (via drill 1)
  other vias: 54.61,55.88
N$684  (via drill 1)
  other vias: 52.07,55.88
N$685  (via drill 1)
  other vias: 49.53,55.88
N$686  (via drill 1)
  other vias: 49.53,53.34
N$687  (via drill 1)
  other vias: 52.07,53.34
N$688  (via drill 1)
  other vias: 54.61,53.34
N$689  (via drill 1)
  other vias: 57.15,53.34
N$690  (via drill 1)
  other vias: 59.69,53.34
N$691  (via drill 1)
  other vias: 62.23,53.34
N$692  (via drill 1)
  other vias: 62.23,50.8
N$693  (via drill 1)
  other vias: 59.69,50.8
N$694  (via drill 1)
  other vias: 57.15,50.8
N$695  (via drill 1)
  other vias: 54.61,50.8
N$696  (via drill 1)
  other vias: 52.07,50.8
N$697  (via drill 1)
  other vias: 49.53,50.8
N$698  (via drill 1)
  other vias: 49.53,48.26
N$699  (via drill 1)
  other vias: 52.07,48.26
N$700  (via drill 1)
  other vias: 54.61,48.26
N$701  (via drill 1)
  other vias: 57.15,48.26
N$702  (via drill 1)
  other vias: 59.69,48.26
N$703  (via drill 1)
  other vias: 62.23,48.26
N$704  (via drill 1)
  other vias: 62.23,45.72
N$705  (via drill 1)
  other vias: 59.69,45.72
N$706  (via drill 1)
  other vias: 57.15,45.72
N$707  (via drill 1)
  other vias: 54.61,45.72
N$708  (via drill 1)
  other vias: 52.07,45.72
N$709  (via drill 1)
  other vias: 62.23,43.18
N$710  (via drill 1)
  other vias: 59.69,43.18
N$711  (via drill 1)
  other vias: 57.15,43.18
N$712  (via drill 1)
  other vias: 54.61,43.18
N$713  (via drill 1)
  other vias: 52.07,43.18
N$714  (via drill 1)
  other vias: 49.53,45.72
N$715  (via drill 1)
  other vias: 49.53,43.18
N$716  (via drill 1)
  other vias: 49.53,40.64
N$717  (via drill 1)
  other vias: 49.53,38.1
N$718  (via drill 1)
  other vias: 49.53,35.56
N$719  (via drill 1)
  other vias: 52.07,40.64
N$720  (via drill 1)
  other vias: 54.61,40.64
N$721  (via drill 1)
  other vias: 57.15,40.64
N$722  (via drill 1)
  other vias: 59.69,40.64
N$723  (via drill 1)
  other vias: 62.23,40.64
N$724  (via drill 1)
  other vias: 52.07,38.1
N$725  (via drill 1)
  other vias: 54.61,38.1
N$726  (via drill 1)
  other vias: 57.15,38.1
N$727  (via drill 1)
  other vias: 59.69,38.1
N$728  (via drill 1)
  other vias: 62.23,38.1
N$729  (via drill 1)
  other vias: 62.23,35.56
N$730  (via drill 1)
  other vias: 59.69,35.56
N$731  (via drill 1)
  other vias: 57.15,35.56
N$732  (via drill 1)
  other vias: 54.61,35.56
N$733  (via drill 1)
  other vias: 52.07,35.56
N$734  (via drill 1)
  other vias: 77.47,55.88
N$735  (via drill 1)
  other vias: 77.47,53.34
N$736  (via drill 1)
  other vias: 77.47,50.8
N$737  (via drill 1)
  other vias: 77.47,48.26
N$738  (via drill 1)
  other vias: 77.47,45.72
N$739  (via drill 1)
  other vias: 77.47,43.18
N$740  (via drill 1)
  other vias: 77.47,40.64
N$741  (via drill 1)
  other vias: 77.47,38.1
N$742  (via drill 1)
  other vias: 77.47,35.56

### Text on the board
tPlace: Desert Lure Rev 1 | GND | GND | VCC | 3V3 | SPI_CS# | UART1_TXD | SPI_MISO | UART1_RXD | SPI_MOSI | UART1_CTS | SPI_CLK | UART1_RTS | I2C_SCL | I2C_CLK | I2C_SDA | I2S_FRM | UART2_TXD | I2S_DO | UART2_RXD | I2S_DI | S5_0 | PWM0 | S5_1 | PWM1 | S5_2 | ILB_8254 | .com